# Altium project ChiptunePlayer-2.22-Keyboard v1.0.PrjPcb
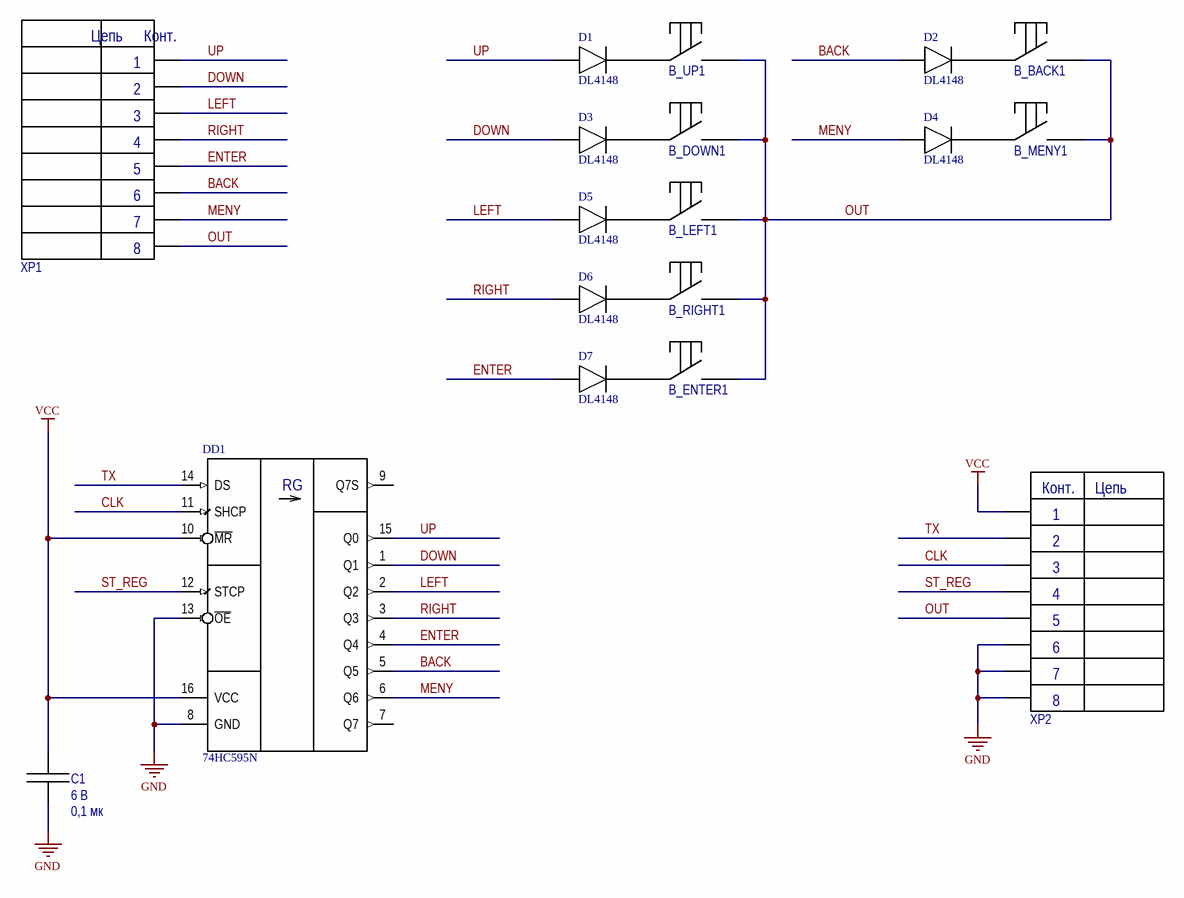
[diagram p0: Main.SchDoc]
1 sheet, 18 parts. Net scope: global (net labels, ports and power ports of the same name join across sheets).
Board file: Main.PcbDoc

## Sheet Main.SchDoc
size 297 x 420 mm; SheetNumber: {}; SheetTotal: {}; PageSetup: Record=PageOptions|CenterHorizontal=False|CenterVertical=False|PrintScale=0.95|XCorrection=0.00|YCorrection=0.00|PrintKind=1|BorderSize=5000000|LeftOffset=0|BottomOffset=0|Orientation=1|PaperLength=1000|PaperWidth=1000|Scale=100|PaperSource=15|PrintQuality=600|MediaType=1|DitherType=10|PaperKind=A4|PrintScaleMode=1; Rule: PcbType=ProtelPcb

### Parts
B_BACK1  Tact_switch  [Tact_switch_6x6x5]  (value not drawn)
B_DOWN1  Tact_switch  [Tact_switch_6x6x5]  (value not drawn)
B_ENTER1  Tact_switch  [Tact_switch_6x6x5]  (value not drawn)
B_LEFT1  Tact_switch  [Tact_switch_6x6x5]  (value not drawn)
B_MENY1  Tact_switch  [Tact_switch_6x6x5]  (value not drawn)
B_RIGHT1  Tact_switch  [Tact_switch_6x6x5]  (value not drawn)
B_UP1  Tact_switch  [Tact_switch_6x6x5]  (value not drawn)
C1  value 0,1 мк  Rated voltage: 6 В  [C_1206_Manual_mount]  (hidden comment: /Укажите код маркировки/)
D1  DL4148  [DL-35]
D2  DL4148  [DL-35]
D3  DL4148  [DL-35]
D4  DL4148  [DL-35]
D5  DL4148  [DL-35]
D6  DL4148  [DL-35]
D7  DL4148  [DL-35]
DD1  74HC595N  [SO16]
XP1  PLD-8  [PLD-8]  (value not drawn)
XP2  PLD-8  [PLD-8]  (value not drawn)

### Nets
GND: C1.2 DD1.8(GND) DD1.13(~{OE}) XP2.6 XP2.7 XP2.8
VCC: C1.1 DD1.10(~{MR}) DD1.16(VCC) XP2.1
BACK: D2.A DD1.5(Q5) XP1.6
CLK: DD1.11(SHCP) XP2.3
DOWN: D3.A DD1.1(Q1) XP1.2
ENTER: D7.A DD1.4(Q4) XP1.5
LEFT: D5.A DD1.2(Q2) XP1.3
MENY: D4.A DD1.6(Q6) XP1.7
OUT: B_BACK1.2 B_DOWN1.2 B_ENTER1.2 B_LEFT1.2 B_MENY1.2 B_RIGHT1.2 B_UP1.2 XP1.8 XP2.5
RIGHT: D6.A DD1.3(Q3) XP1.4
ST_REG: DD1.12(STCP) XP2.4
TX: DD1.14(DS) XP2.2
UP: D1.A DD1.15(Q0) XP1.1
NetB_BACK1_1: B_BACK1.1 D2.C
NetB_DOWN1_1: B_DOWN1.1 D3.C
NetB_ENTER1_1: B_ENTER1.1 D7.C
NetB_LEFT1_1: B_LEFT1.1 D5.C
NetB_MENY1_1: B_MENY1.1 D4.C
NetB_RIGHT1_1: B_RIGHT1.1 D6.C
NetB_UP1_1: B_UP1.1 D1.C

Not connected (* = marked no-connect by the designer): DD1 7(Q7) 9(Q7S)

### Notes on the sheet
- Подп. и дата
- Инв. № дубл.
- Взам. инв. №
- Инв. № подл.
- Лист
- Изм.
- № докум.
- Подп.
- Дата
- Копировал
- Формат А3
- (in symbol 74HC595N) RG
- (in symbol PLD-8) Цепь; Конт.

### Library data of the parts
B_BACK1 B_DOWN1 B_ENTER1 B_LEFT1 B_MENY1 B_RIGHT1 B_UP1 = Tact_switch: SMD pushbutton; Manufacturer: NONAME; Junction resistance: 100 мОм; Rated voltage: 12 В; Rated current: 50 мА; Life cycles: 100000; Type: Выключатель кнопочный с самовозвратом
C1 = Capacitor 1206: SMD Capacitor 1206; Manufacturer: /Укажите компанию-производителя/; Tolerance: /Укажите допуск в процентах/; Temperature coefficient: /Формат: ±? ppm/°C/; Type: Конденсатор керамический; TC: /Укажите тип диэлектрика/; Size: 1206; Temperature range: /Формат: -? ... ? °C/
XP1 XP2 = PLD-8: PLD connector; Manufacturer: NONAME; Connector type: Вилка на плату; Number of contacts: 8; Type: Разъем штыревой